# EAGLE schematic p3 (EAGLE 6.4)
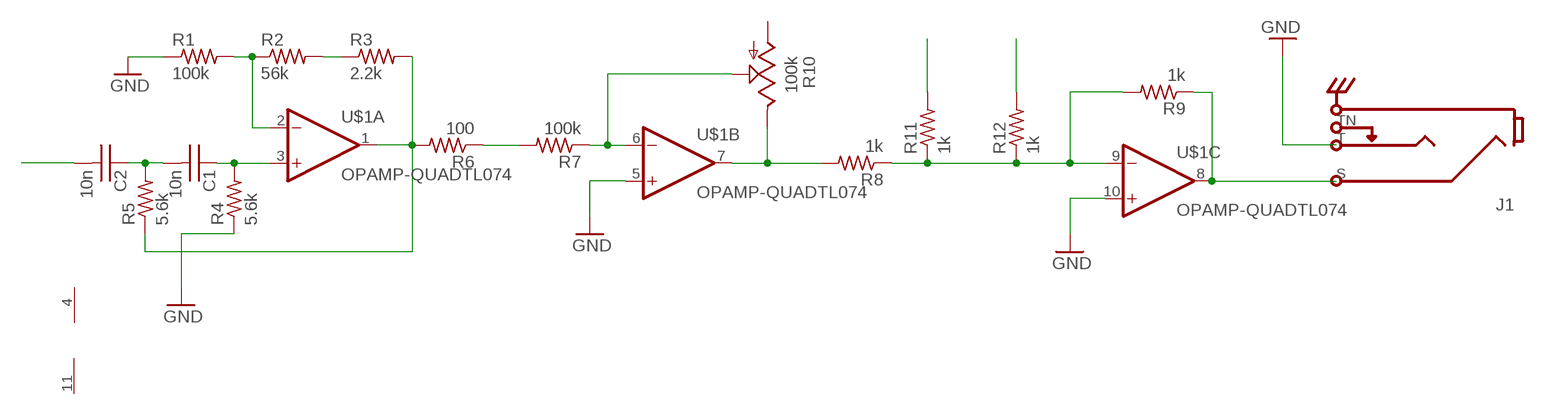
[diagram p0: schematic, sheet 1]

## Parts
C1  10n  CAPACITOR  [BOX-2.5MM-7.2MM]
C2  10n  CAPACITOR  [BOX-2.5MM-7.2MM]
J1  MONOSW1GND  [NEUTRIK-NRJ4HM-1]
R1  100k  RESISTOR0.25W-0.4IN-METALFILM  [0.25W-0.4IN-METALFILM]
R2  56k  RESISTOR0.25W-0.4IN-METALFILM  [0.25W-0.4IN-METALFILM]
R3  2.2k  RESISTOR0.25W-0.4IN-METALFILM  [0.25W-0.4IN-METALFILM]
R4  5.6k  RESISTOR0.25W-0.4IN-METALFILM  [0.25W-0.4IN-METALFILM]
R5  5.6k  RESISTOR0.25W-0.4IN-METALFILM  [0.25W-0.4IN-METALFILM]
R6  100  RESISTOR0.25W-0.4IN-METALFILM  [0.25W-0.4IN-METALFILM]
R7  100k  RESISTOR0.25W-0.4IN-METALFILM  [0.25W-0.4IN-METALFILM]
R8  1k  RESISTOR0.25W-0.4IN-METALFILM  [0.25W-0.4IN-METALFILM]
R9  1k  RESISTOR0.25W-0.4IN-METALFILM  [0.25W-0.4IN-METALFILM]
R10  100k  POTENTIOMETERHORIZONTAL  [POT-SIDE-16MM-BITECH-P160KN]
R11  1k  RESISTOR0.25W-0.4IN  [0.25W-0.4IN]
R12  1k  RESISTOR0.25W-0.4IN  [0.25W-0.4IN]
U$1  OPAMP-QUADTL074  [DIP14]

## Nets
0: J1.T R1.1 R4.1 U$1.5(B:IN+) U$1.10(C:IN+)
N$1: R1.2 R2.1 U$1.2(A:IN-)
N$2: R2.2 R3.1
N$3: R3.2 R5.1 R6.2 U$1.1(A:OUT)
N$4: R6.1 R7.2
N$5: R7.1 R10.P$2 U$1.6(B:IN-)
N$6: R8.2 R10.P$3 U$1.7(B:OUT)
N$7: R8.1 R9.2 R11.1 R12.1 U$1.9(C:IN-)
N$8: J1.S R9.1 U$1.8(C:OUT)
N$9: C1.P$1 R4.2 U$1.3(A:IN+)
N$10: C1.P$2 C2.P$1 R5.2
N$11: C2.P$2
N$14: R11.2
N$15: R12.2
Unconnected: J1.TN R10.P$1 U$1.12(D:IN+) U$1.13(D:IN-) U$1.14(D:OUT)

## Power pins joined to a net without a drawn wire
VCC: U$1.4(SUP:VCC)
VEE: U$1.11(SUP:VEE)

## Library data of the parts
C1 C2 = Capacitors:CAPACITOR: Capacitor; SPICE: C{NAME} {1.NET} {2.NET} {VALUE}
J1 = Audio Jacks 0.25 inch:MONOSW1GND: 1/4" mono jack, switched (unswitched sleeve), with chassis ground connection
R1-R9 R11 R12 = Resistors:RESISTOR: Resistor; SPICE: R{NAME} {1.NET} {2.NET} {VALUE}
R10 = Potentiometers:POTENTIOMETER: Potentiometer; PERCENT: 50; SPICE: R{NAME}CW {3.NET} {2.NET} {{{VALUE} - {{{ATTR.PERCENT} / 100} * {VALUE}}} + 0.001}\nR{NAME}CCW {2.NET} {1.NET} {{{{ATTR.PERCENT} / 100} * {VALUE}} + 0.001}
U$1 = Op Amps:OPAMP-QUAD: Operational amplifier, quad; SPICE: X{NAME}A {A.IN+.NET} {A.IN-.NET} {VCC.NET} {VEE.NET} {A.OUT.NET} TL074\nX{NAME}B {B.IN+.NET} {B.IN-.NET} {VCC.NET} {VEE.NET} {B.OUT.NET} TL074\nX{NAME}C {C.IN+.NET} {C.IN-.NET} {VCC.NET} {VEE.NET} {C.OUT.NET} TL074\nX{NAME}D {D.IN+.NET} {D.IN-.NET} {VCC.NET} {VEE.NET} {D.OUT.NET} TL074; SPICEMOD: .SUBCKT TL074 1 2 3 4 5\nC1 11 12 3.498E-12\nC2 6 7 15.00E-12\nDC 5 53 DX\nDE 54 5 DX\nDLP 90 91 DX\nDLN 92 90 DX\nDP 4 3 DX\nEGND 99 0 POLY(2) (3,0) (4,0) 0 .5 .5\nFB 7 99 POLY(5) VB VC VE VLP VLN 0 4.715E6 -5E6 5E6 5E6 -5E6\nGA 6 0 11 12 282.8E-6\nGCM 0 6 10 99 8.942E-9\nISS 3 10 DC 195.0E-6\nHLIM 90 0 VLIM 1K\nJ1 11 2 10 JX\nJ2 12 1 10 JX\nR2 6 9 100.0E3\nRD1 4 11 3.536E3\nRD2 4 12 3.536E3\nRO1 8 5 150\nRO2 7 99 150\nRP 3 4 2.143E3\nRSS 10 99 1.026E6\nVB 9 0 DC 0\nVC 3 53 DC 2.200\nVE 54 4 DC 2.200\nVLIM 7 8 DC 0\nVLP 91 0 DC 25\nVLN 0 92 DC 25\n.MODEL DX D(IS=800.0E-18)\n.MODEL JX PJF(IS=15.00E-12 BETA=270.1E-6 VTO=-1)\n.ENDS

## Net classes
0 default: width 1.27 mm, drill 1.27 mm, clearance 0.254 mm